# Altium schematic sheet sd_flash_eeprom.SchDoc
size A4; SheetNumber: 9; SheetTotal: 21
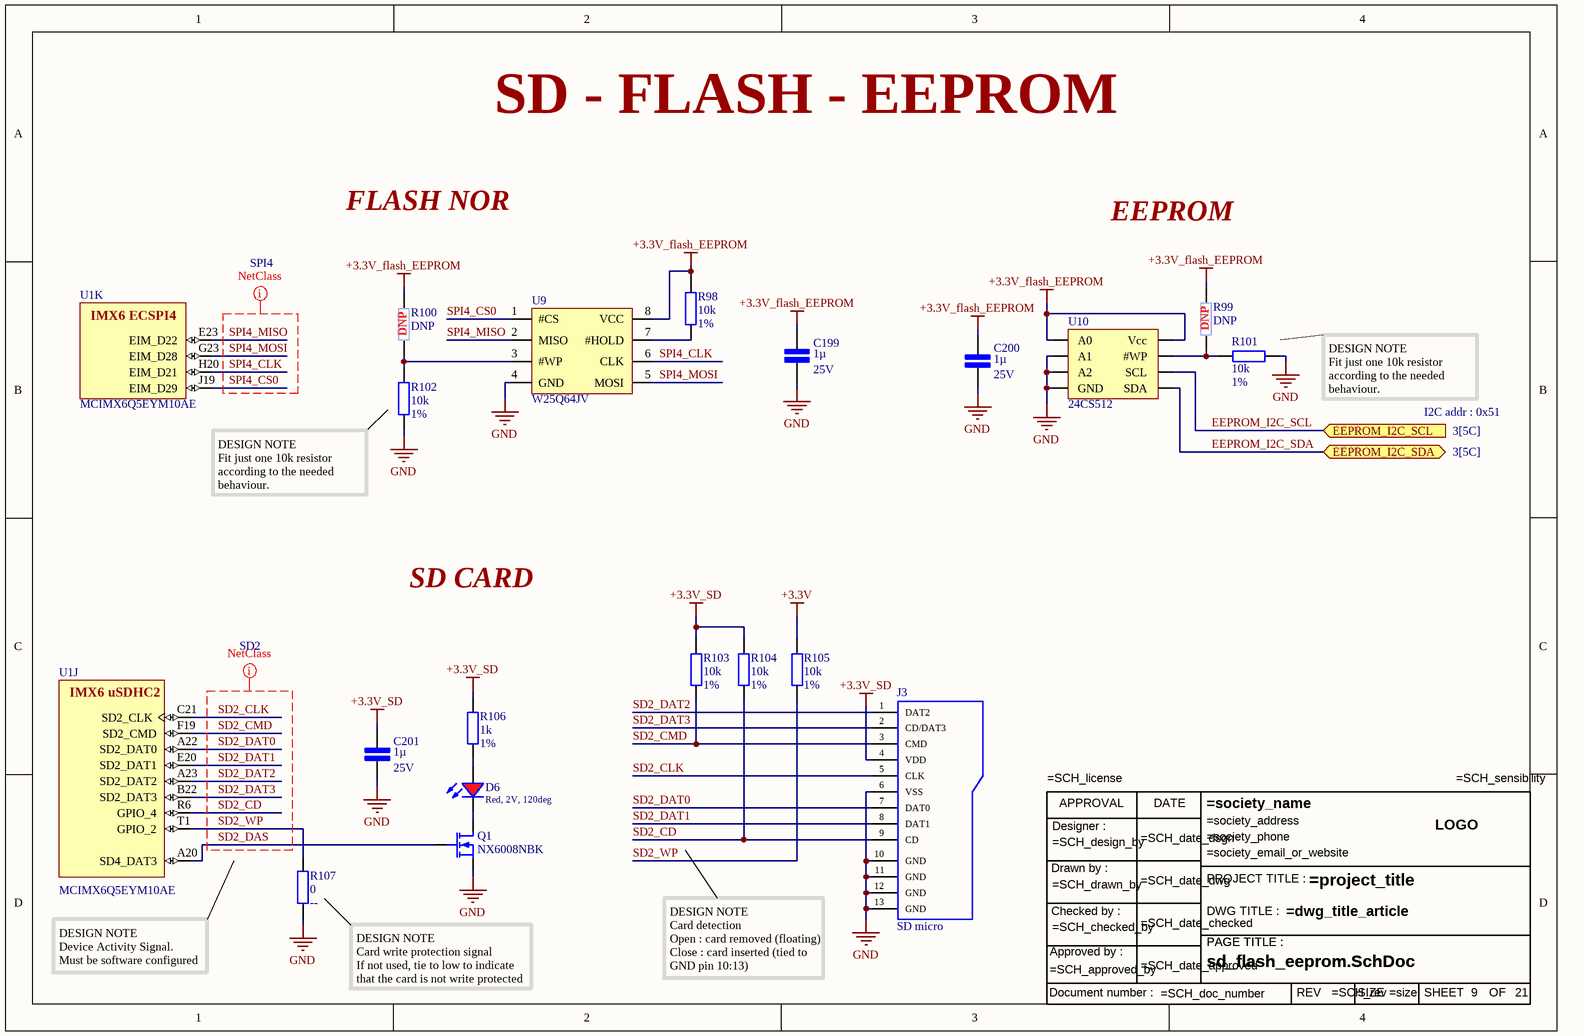
[diagram p0: sd_flash_eeprom.SchDoc]

## Parts
C199  1µ  Tension du diélectrique: 25V  [Cap cer 0402/1005]
C200  1µ  Tension du diélectrique: 25V  [Cap cer 0402/1005]
C201  1µ  Tension du diélectrique: 25V  [Cap cer 0402/1005]
D6  Red, 2V, 120deg  [LED red 0603]
J3  SD micro  [SD_micro_693071020811]
Q1  NX6008NBK  [Sot-23-3 mosfet]
R98  10k  pourcentage: 1%  [Res 0402/1005]
R99  DNP  [Res 0402/1005]
R100  DNP  [Res 0402/1005]
R101  10k  pourcentage: 1%  [Res 0402/1005]
R102  10k  pourcentage: 1%  [Res 0402/1005]
R103  10k  pourcentage: 1%  [Res 0402/1005]
R104  10k  pourcentage: 1%  [Res 0402/1005]
R105  10k  pourcentage: 1%  [Res 0402/1005]
R106  1k  pourcentage: 1%  [Res 0402/1005]
R107  0  [Res 0603/1603]
TB8  Title bloc ANSI modified  (value not drawn)
U1  MCIMX6Q5EYM10AE  [FRES-2197-01]  (parts J,K of 21)
U9  W25Q64JV  [SOIC 8 pin FLSH (longer)]
U10  24CS512  [soic-8]

## Ports
EEPROM_I2C_SCL (in, see 3[5C]), EEPROM_I2C_SDA (bidir, see 3[5C])

## Nets
+3.3V: R105.2
+3.3V_flash_EEPROM: C199.1 C200.1 R98.2 R99.2 R100.2 U9.8(VCC) U10.1(A0) U10.8(Vcc)
+3.3V_SD: C201.1 J3.4(VDD) R103.2 R104.2 R106.2
GND: C199.2 C200.2 C201.2 J3.6(VSS) J3.10(GND) J3.11(GND) J3.12(GND) J3.13(GND) Q1.S R101.1 R102.1 R107.1 U9.4(GND) U10.2(A1) U10.3(A2) U10.4(GND)
EEPROM_I2C_SCL: U10.6(SCL) ; port EEPROM_I2C_SCL
EEPROM_I2C_SDA: U10.5(SDA) ; port EEPROM_I2C_SDA
SD2_CD: J3.9(CD) R104.1 U1.R6(GPIO_4)
SD2_CLK: J3.5(CLK) U1.C21(SD2_CLK)
SD2_CMD: J3.3(CMD) R103.1 U1.F19(SD2_CMD)
SD2_DAS: Q1.G U1.A20(SD4_DAT3)
SD2_DAT0: J3.7(DAT0) U1.A22(SD2_DAT0)
SD2_DAT1: J3.8(DAT1) U1.E20(SD2_DAT1)
SD2_DAT2: J3.1(DAT2) U1.A23(SD2_DAT2)
SD2_DAT3: J3.2(CD/DAT3) U1.B22(SD2_DAT3)
SD2_WP: R105.1 R107.2 U1.T1(GPIO_2)
SPI4_CLK: U1.H20(EIM_D21) U9.6(CLK)
SPI4_CS0: U1.J19(EIM_D29) U9.1(#CS)
SPI4_MISO: U1.E23(EIM_D22) U9.2(MISO)
SPI4_MOSI: U1.G23(EIM_D28) U9.5(MOSI)
NetD6_1: D6.1(K) Q1.D
NetD6_2: D6.2(A) R106.1
NetR98_1: R98.1 U9.7(#HOLD)
NetR99_1: R99.1 R101.2 U10.7(#WP)
NetR100_1: R100.1 R102.2 U9.3(#WP)

## Layout directives
net class SPI4: SPI4_CLK, SPI4_CS0, SPI4_MISO, SPI4_MOSI
net class SD2: SD2_CD, SD2_CLK, SD2_CMD, SD2_DAS, SD2_DAT0, SD2_DAT1, SD2_DAT2, SD2_DAT3, SD2_WP

## Notes on the sheet
- SD - FLASH - EEPROM
- FLASH NOR
- EEPROM
- DESIGN NOTE
  Fit just one 10k resistor according to the needed behaviour.
  Pull down by default
- I2C addr : 0x51
- SD CARD
- DESIGN NOTE
  Device Activity Signal.
  Must be software configured
- DESIGN NOTE
  Card write protection signal
  If not used, tie to low to indicate that the card is not write protected
- DESIGN NOTE
  Card detection
  Open : card removed (floating)
  Close : card inserted (tied to GND pin 10:13)
- (in symbol IMX6Q5EYM10AE, part J) IMX6 uSDHC2
- (in symbol IMX6Q5EYM10AE, part K) IMX6 ECSPI4
- (in symbol Title bloc ANSI) APPROVAL; DATE; Designer :; LOGO; Drawn by :; PROJECT TITLE :; Checked by :; DWG TITLE :; PAGE TITLE :; Approved by :; Document number :; REV; SIZE; SHEET; OF

## Library data of the parts
C199-C201 = cap 1µ 25V: cap cer 1µ 25V 10% X5R 0402; Diélectrique: X5R
D6 = LED Red 0603: WL-SMCC SMD Mono-color Chip LED Compact, size 0603, Red, 2V, 120deg 150060RS73220; Dominant Wavelength: 624nm; Luminous Intensity: 90mcd; Peak Wavelength: 632nm; Chip Technology: AlInGaP; ComponentLink1URL: http://www.we-online.de; ComponentLink2Description: Datasheet; ComponentLink2URL: https://katalog.we-online.com/led/datasheet/150060RS73220.pdf; Part Number: 150060RS73220; Published Date: July 2019; Publisher: Wurth Elektronik; Size: 0603; Viewing Angle: 120deg; Packaging: Tape and Reel; Emitting Color: Red; Mounting Technology: SMT; Forward Voltage: 2V; Operating Temperature: -40 to +85degC
J3 = SD_micro_693071020811: SD micro card, push & push
Q1 = Tr nmos NX6008NBK: SOT-23-3 270mA 60V ESD protected 2kV HBM
R98 R101-R105 = res 10k 1%: res 10k 1% 0402
R99 R100 = res DNP 0402: res DNP 0403; pourcentage: 1%
R106 = res 1k 1%: res 1k 1% 0402
R107 = res 0Ohm: res 0603; pourcentage: --
TB8 = Title bloc ANSI
U1 = IMX6Q5EYM10AE: 32-Bit i.MX 6 Quad Application Processor, 1 GHz, 256 KB RAM, Extended Consumer Grade, 624-Pin FCPBGA, RoHS, Tape and Reel; PartNumber: MCIMX6Q5EYM10ACR; Manufacturer: Freescale Semiconductor; CAN: FlexCAN; Number of Cores: 4 Spec; External Memory Supported: DDR3, DDR3L, FLASH, LPDDR2; Speed Grade: 1 GHz; Core Type: ARM Cortex A9; Cache (KB): 32; Ethernet: 1 Gbps + IEEE 1588; Internal RAM (KB): 256; ComponentLink1Description: Manufacturer URL; ComponentLink2Description: Datasheet; DatasheetVersion: Rev. 2.3; ComponentLink3URL: http://cache.freescale.com/files/32bit/doc/data_sheet/IMX6DQCEC.pdf?fpsp=1&WT_TYPE=Data%20Sheets&WT_VENDOR=FREESCALE&WT_FILE_FORMAT=pdf&WT_ASSET=Documentation; ComponentLink1URL: http://www.freescale.com/; Packing: Tape and Reel; Temperature Range: -20 to 105 degC; ComponentLink2URL: http://cache.freescale.com/files/32bit/doc/data_sheet/IMX6DQCEC.pdf?fpsp=1&WT_TYPE=Data%20Sheets&WT_VENDOR=FREESCALE&WT_FILE_FORMAT=pdf&WT_ASSET=Documentation; ComponentLink3Description: Package Specification; PackageVersion: Rev. A; RoHS: TRUE; Quad/Dual CPU: i.MX 6Quad; Mounting Technology: Surface Mount; PackageReference: FCPBGA-624; PackageDescription: 624-pin Ball Grid Array Package, Body 21 x 21mm, Pitch 0.8mm
U9 = IC W25Q64JV: 64Mbit flash NOR
U10 = IC 24CS512: EEPROM 512kbit